# Altium schematic sheet Cover Page.SchDoc: Cover Page
size A4; Author: DO DANH LUONG; Revision: 1.0; SheetNumber: 1; SheetTotal: 6; ProjectTitle: DSP_VERSION_1.0
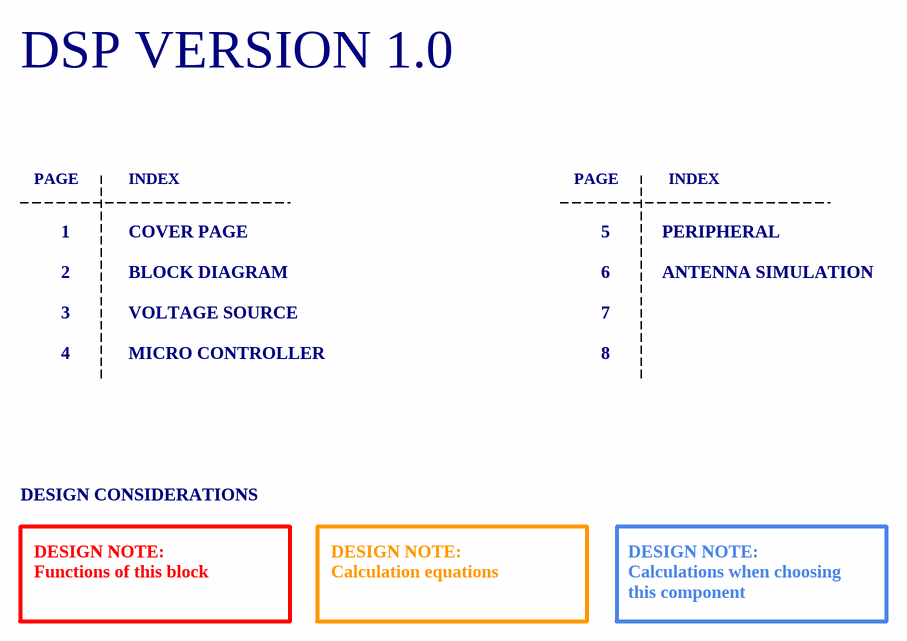
[diagram p0: Cover Page.SchDoc]

## Notes on the sheet
- DSP VERSION 1.0
- PAGE
- 1
- INDEX
- COVER PAGE
- 5
- PERIPHERAL
- 2
- BLOCK DIAGRAM
- 6
- ANTENNA SIMULATION
- 3
- 4
- VOLTAGE SOURCE
- MICRO CONTROLLER
- 7
- 8
- DESIGN CONSIDERATIONS
- DESIGN NOTE:
  Functions of this block
- DESIGN NOTE:
  Calculation equations
- DESIGN NOTE:
  Calculations when choosing this component
- Author:
- Title:
- Size:
- A4
- Project:
- Approved:
- Revision:
- Modified Date:
- CONFIDENTIAL
- Date:
- SW Version: